# EAGLE design LCD1602_IIC_Interface_Board (EAGLE 8.2.2)
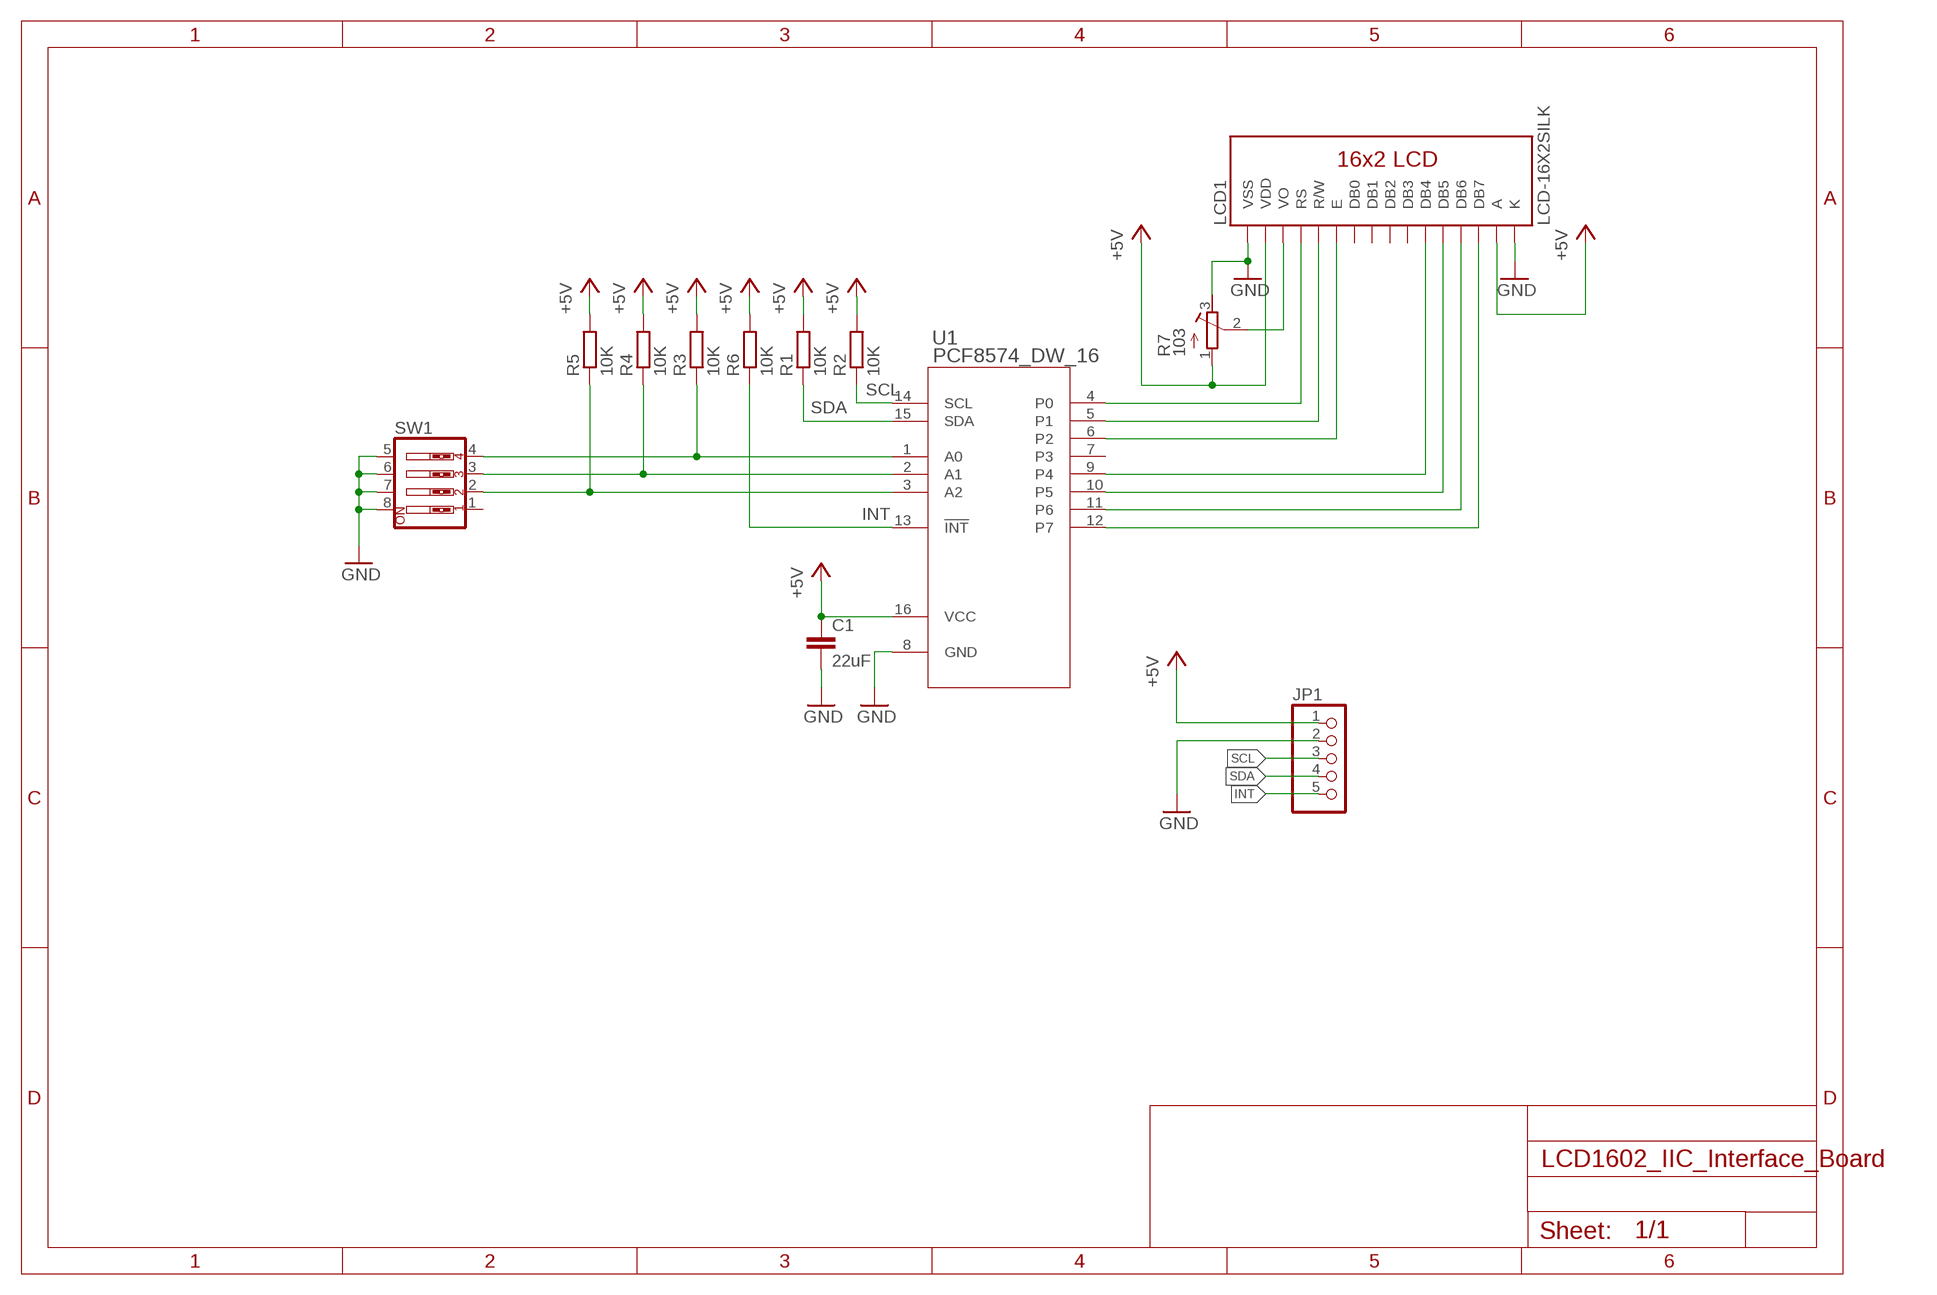
[diagram p0: schematic, sheet 1]

## Parts
C1  22uF  C-EUC1206  [C1206]
JP1  PINHD-1X5  [1X05]
LCD1  LCD-16X2SILK  [LCD-16X2]
R1  10K  R-EU_R0603  [R0603]
R2  10K  R-EU_R0603  [R0603]
R3  10K  R-EU_R0603  [R0603]
R4  10K  R-EU_R0603  [R0603]
R5  10K  R-EU_R0603  [R0603]
R6  10K  R-EU_R0603  [R0603]
R7  103  R-TRIMM3296W  [RTRIM3296W]
SW1  SW_DIP-4  [EDG-04]
U1  PCF8574_DW_16  [DW16]

## Nets
+5V: C1.1 JP1.1 LCD1.2(VDD) LCD1.15(A) R1.2 R2.2 R3.2 R4.2 R5.2 R6.2 R7.1(A) U1.16(VCC)
GND: C1.2 JP1.2 LCD1.1(VSS) LCD1.16(K) R7.3(E) SW1.5 SW1.6 SW1.7 SW1.8 U1.8(GND)
INT: JP1.5 R6.1 U1.13(!INT)
N$1: LCD1.4(RS) U1.4(P0)
N$2: LCD1.5(R/W) U1.5(P1)
N$3: LCD1.11(DB4) U1.9(P4)
N$4: LCD1.12(DB5) U1.10(P5)
N$5: LCD1.13(DB6) U1.11(P6)
N$6: LCD1.14(DB7) U1.12(P7)
N$7: LCD1.6(E) U1.6(P2)
N$8: R3.1 SW1.4 U1.1(A0)
N$9: R4.1 SW1.3 U1.2(A1)
N$10: R5.1 SW1.2 U1.3(A2)
N$12: LCD1.3(VO) R7.2(S)
SCL: JP1.3 R2.1 U1.14(SCL)
SDA: JP1.4 R1.1 U1.15(SDA)
Unconnected: LCD1.7(DB0) LCD1.8(DB1) LCD1.9(DB2) LCD1.10(DB3) SW1.1 U1.7(P3)

## Library data of the parts
C1 = resistor:C-EU: CAPACITOR, European symbol
JP1 = pinhead:PINHD-1X5: PIN HEADER
LCD1 = SparkFun-Displays:LCD-16X2: Standard text-only 16x2 parallel input LCD Basic 16 character by 2 line display. Typically utilizes the extremely common HD44780 parallel interface chipset SparkFun Products: Basic 16x2 Green <https://www.sparkfun.com/products/255> Basic 8x2 Green <https://www.sparkfun.com/products/11122>; SF_ID: LCD-00255
R1-R6 = resistor:R-EU_: RESISTOR, European symbol
R7 = resistor:R-TRIMM: Trimm resistor
SW1 = special:SW_DIP-4: DIP SWITCH
U1 = texas_instrument:PCF8574_DW_16; MANUFACTURER_PART_NUMBER: pcf8574_dw_16; VENDOR: Texas Instruments

## Board
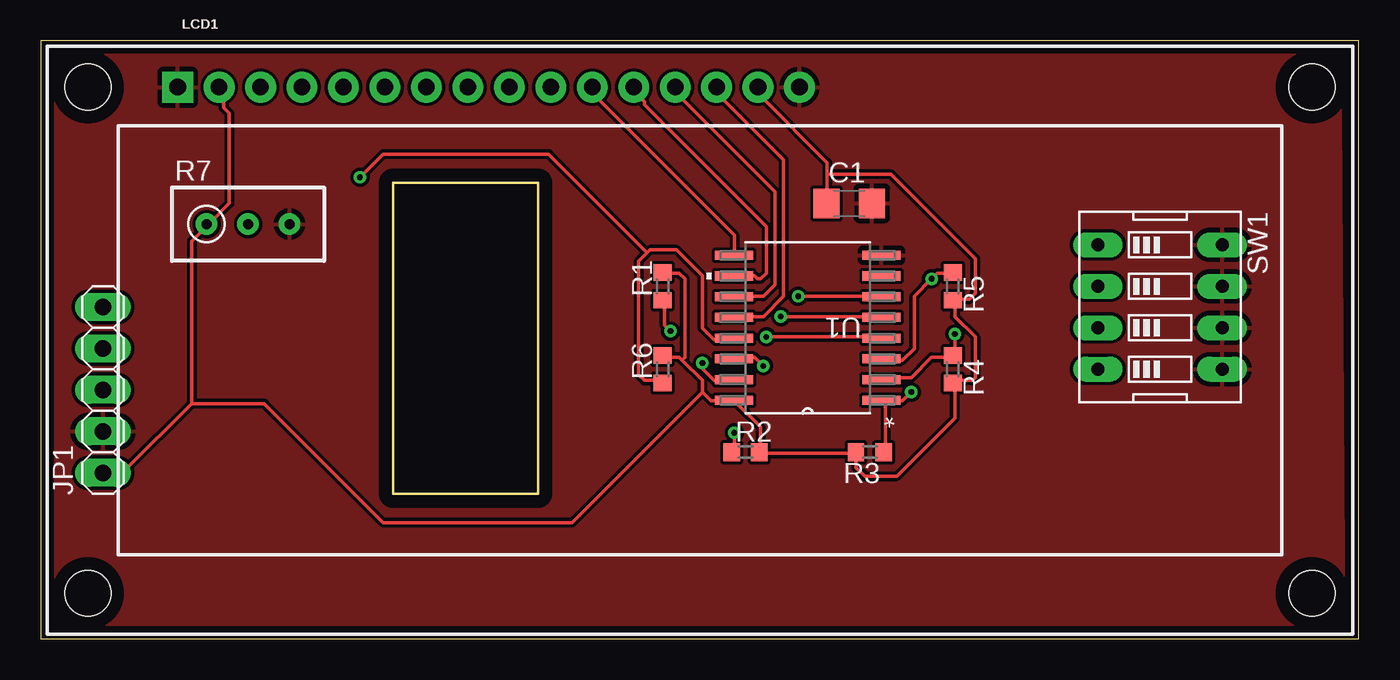
[diagram p1: board, top side]
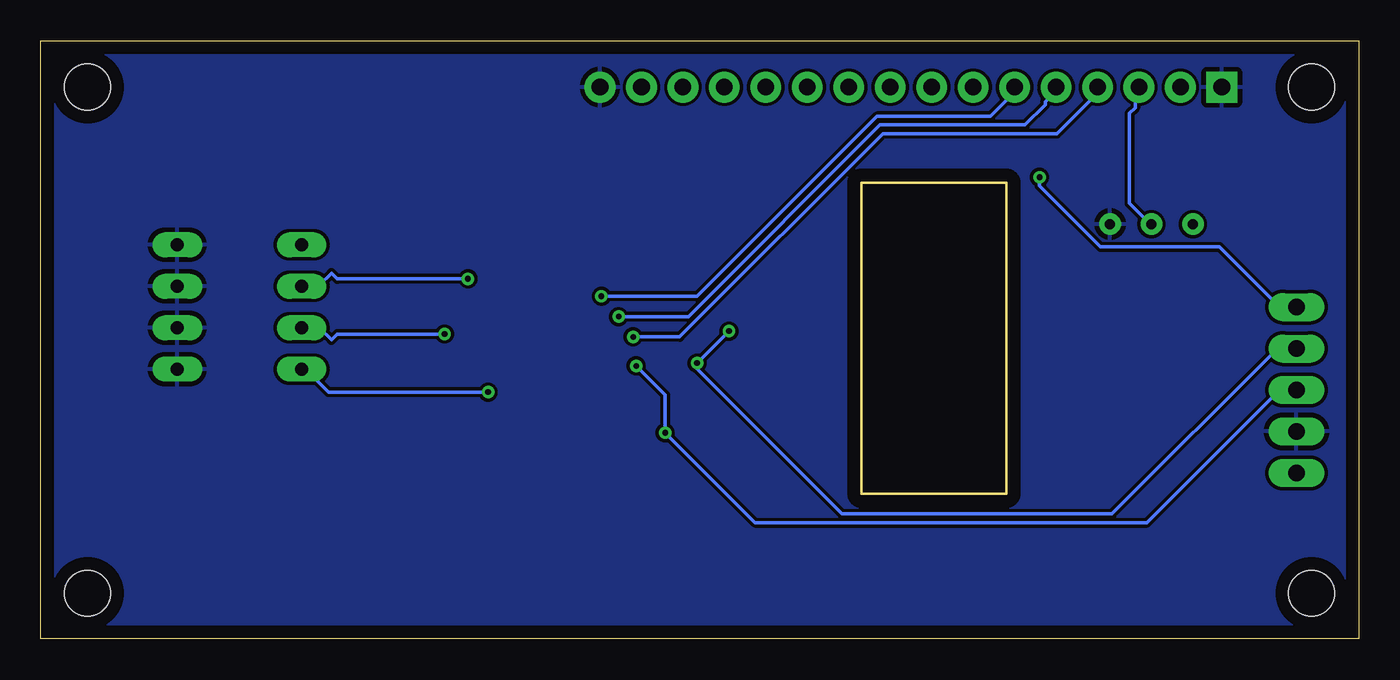
[diagram p2: board, bottom side, seen from below]

Size 80.75 x 36.63 mm. Coordinates in mm from the lower left corner, seen from the top.
Outline: 0,0 80.75,0 80.75,36.63 0,36.63 0,0
Outline: 21.59,27.94 21.59,8.89 30.48,8.89 30.48,27.94 21.59,27.94
Copper layers (1*16): Top 0.035mm / dielectric 1.5mm / Bottom 0.035mm
Design rules "SZ-JLC *": minimum track width 8mil, minimum drill 0.35mm, track to track 8mil, track to pad 8mil, pad to pad 8mil, via to via 8mil, smd to smd 8mil, copper to edge 0.8mm, drill to drill 10mil, minimum pad ring 14mil, minimum via ring 8mil, stop-mask expansion 4mil, vias tented up to drill 38mil, thermal gap 0.3mm

### Footprints (pad centres in the part's own frame; a part is rotated, then mirrored left to right if it is on the bottom)
C1206 = smd 1.6 x 1.8: 1 -1.4,0; 2 1.4,0
1X05 = drill 1.016 long: 1 -5.08,0; 2 -2.54,0; 3 0,0; 4 2.54,0; 5 5.08,0
LCD-16X2 = drill 1.016 pad 1.88 square: 1 -32,15.5 | drill 1.016 pad 1.88: 2 -29.46,15.5; 3 -26.92,15.5; 4 -24.38,15.5; 5 -21.84,15.5; 6 -19.3,15.5; 7 -16.76,15.5; 8 -14.22,15.5; 9 -11.68,15.5; 10 -9.14,15.5; 11 -6.6,15.5; 12 -4.06,15.5; 13 -1.52,15.5; 14 1.02,15.5; 15 3.56,15.5; 16 6.1,15.5 | hole 2.8: -37.5,15.5; -37.5,-15.5; 37.5,15.5; 37.5,-15.5
R0603 = smd 1 x 1.1: 1 -0.85,0; 2 0.85,0
RTRIM3296W = drill 0.61: 1 0,-2.54; 2 0,0; 3 0,2.54
EDG-04 = drill 0.813 long: 1 -3.81,-3.81; 2 -1.27,-3.81; 3 1.27,-3.81; 4 3.81,-3.81; 5 3.81,3.81; 6 1.27,3.81; 7 -1.27,3.81; 8 -3.81,3.81
DW16 = smd 2.311 x 0.559: 1 -4.521,4.445; 2 -4.521,3.175; 3 -4.521,1.905; 4 -4.521,0.635; 5 -4.521,-0.635; 6 -4.521,-1.905; 7 -4.521,-3.175; 8 -4.521,-4.445; 9 4.521,-4.445; 10 4.521,-3.175; 11 4.521,-1.905; 12 4.521,-0.635; 13 4.521,0.635; 14 4.521,1.905; 15 4.521,3.175; 16 4.521,4.445

### Placement (x,y rotation side)
C1  49.53,26.67 0 top
JP1  3.81,15.24 90 top
LCD1  40.39,18.29 0 top
R1  38.1,21.59 90 top
R2  43.18,11.43 0 top
R3  50.8,11.43 180 top
R4  55.88,16.51 270 top
R5  55.88,21.59 270 top
R6  38.1,16.51 90 top
R7  12.7,25.4 270 top
SW1  68.58,20.32 270 top
U1  46.99,19.05 180 top

### Tracks (layer width: path | path; a pad name or v marks a point on that pad's centre or on a via)
+5V
  Top 0.203: LCD1.2 11.02,33.78 11.2,33.6 11.2,32.54 11.56,32.18 11.56,26.67 10.31,25.43 R7.1 10.13,25.25 9.25,24.36 9.25,14.4 | 9.25,14.4 5.16,10.31 3.91,10.31 JP1.1 | 48.18,28.45 48.18,29.16 44.09,33.25 44.09,33.78 LCD1.15 | 48.18,28.45 48.18,26.67 C1.1 | 39.29,17.07 40.54,15.82 40.54,15.11 | 39.29,17.07 39.12,17.25 38.23,17.25 R6.2 | 40.54,15.11 41.07,14.58 42.32,14.58 U1.16 42.49,14.76 42.67,14.58 42.67,14.4 44.09,12.98 44.09,11.56 R2.2 44.09,11.38 49.78,11.38 R3.2 49.96,11.38 49.96,10.49 50.49,9.96 52.45,9.96 56.01,13.51 56.01,15.65 R4.2 56.01,15.82 57.07,15.82 57.25,16 57.25,18.49 56.01,19.74 56.01,20.62 R5.2 56.01,20.8 56.9,20.8 57.25,21.16 57.25,23.29 52.09,28.45 48.18,28.45 | 39.29,17.07 39.47,17.25 39.47,22.05 39.12,22.4 38.23,22.4 R1.2 | 9.25,14.4 13.69,14.4 20.98,7.11 32.54,7.11 40.54,15.11
GND
  pour Top: 0.25,36.83 79.63,36.7 79.88,0.51 0.51,0.38
  pour Bottom: 0.51,36.7 79.88,36.7 79.88,0.51 0.51,0.25
INT  (via drill 0.35)
  Top 0.203: 37.16,23.65 37.34,23.82 38.94,23.82 40.54,22.23 40.54,19.02 41.25,18.31 42.32,18.31 U1.13 | 37.16,23.65 36.63,23.11 36.63,16.18 36.98,15.82 38.05,15.82 R6.1 | v19.56,28.27 20.98,29.69 31.11,29.69 37.16,23.65
  Bottom 0.203: v19.56,28.27 19.56,27.74 15.82,24 8.53,24 4.98,20.45 3.91,20.45 JP1.5
N$1  (via drill 0.35)
  Top 0.203: v44.45,18.49 51.38,18.49 U1.4
  Bottom 0.203: v44.45,18.49 41.6,18.49 29.16,30.94 18.49,30.94 16.18,33.25 16.18,33.78 LCD1.4
N$2  (via drill 0.35)
  Top 0.203: v45.34,19.74 51.38,19.74 U1.5
  Bottom 0.203: v45.34,19.74 41.07,19.74 29.34,31.47 20.45,31.47 19.2,32.72 19.2,32.89 18.67,33.43 18.67,33.78 LCD1.5
N$3
  Top 0.203: U1.9 42.49,23.65 42.49,24.71 33.96,33.25 33.96,33.78 LCD1.11
N$4
  Top 0.203: U1.10 43.74,22.23 43.92,22.05 44.09,22.05 44.45,22.4 44.45,25.25 36.98,32.72 36.98,32.89 36.45,33.43 36.45,33.78 LCD1.12
N$5
  Top 0.203: U1.11 42.49,20.98 44.27,20.98 44.98,21.69 44.98,27.38 38.94,33.43 38.94,33.78 LCD1.13
N$6
  Top 0.203: U1.12 42.49,19.74 44.27,19.74 45.52,20.98 45.52,29.34 41.43,33.43 41.43,33.78 LCD1.14
N$7  (via drill 0.35)
  Top 0.203: v46.41,20.98 51.38,20.98 U1.6
  Bottom 0.203: v46.41,20.98 40.54,20.98 29.52,32 22.58,32 21.16,33.43 21.16,33.78 LCD1.6
N$8  (via drill 0.35)
  Top 0.203: 51.74,14.58 51.74,11.56 R3.1 | 51.74,14.58 51.56,14.76 U1.1 51.74,14.58 | v53.34,15.11 52.81,14.58 51.74,14.58
  Bottom 0.203: v53.34,15.11 63.12,15.11 64.36,16.36 64.72,16.36 SW1.4
N$9  (via drill 0.35)
  Top 0.203: U1.2 51.56,16 53.34,16 54.59,17.25 55.83,17.25 R4.1 56.01,17.42 v56.01,18.67
  Bottom 0.203: v56.01,18.67 62.59,18.67 62.94,18.31 63.65,19.02 64.72,19.02 SW1.3
N$10  (via drill 0.35)
  Top 0.203: R5.1 55.83,22.4 54.94,22.4 v54.59,22.05 53.52,20.98 53.52,17.78 52.81,17.07 51.56,17.07 U1.3
  Bottom 0.203: v54.59,22.05 62.59,22.05 62.94,22.4 63.65,21.69 64.72,21.69 SW1.2
N$12
  Bottom 0.203: R7.2 12.8,25.43 14.05,26.67 14.05,32.18 13.69,32.54 13.69,33.6 13.51,33.78 LCD1.3
SCL  (via drill 0.35)
  Top 0.203: v42.49,12.62 42.49,11.56 R2.1 | v44.27,16.71 43.74,17.25 42.49,17.25 U1.14
  Bottom 0.203: v44.27,16.71 42.49,14.94 v42.49,12.62 36.98,7.11 12.98,7.11 4.98,15.11 3.91,15.11 JP1.3
SDA  (via drill 0.35)
  Top 0.203: v38.58,18.85 38.23,19.2 38.23,20.62 R1.1 | v40.54,16.89 40.54,16.54 41.25,15.82 42.32,15.82 U1.15
  Bottom 0.203: v38.58,18.85 v40.54,16.89 40.54,16.54 31.65,7.64 15.11,7.64 4.98,17.78 JP1.4